# EasyEDA Pro project TES_Controller_V1.2.eprj

# Schematic Schematic1

## Sheets
1 P1: Board Name: Board1; Create Date: 2025-09-07; Page Name: P1; Project Name: TES_Controller_V1.2; Schematic Name: Schematic1; Update Date: 2025-09-17; Company: EasyEDA.com; Page Size: A4; Version: V1.0
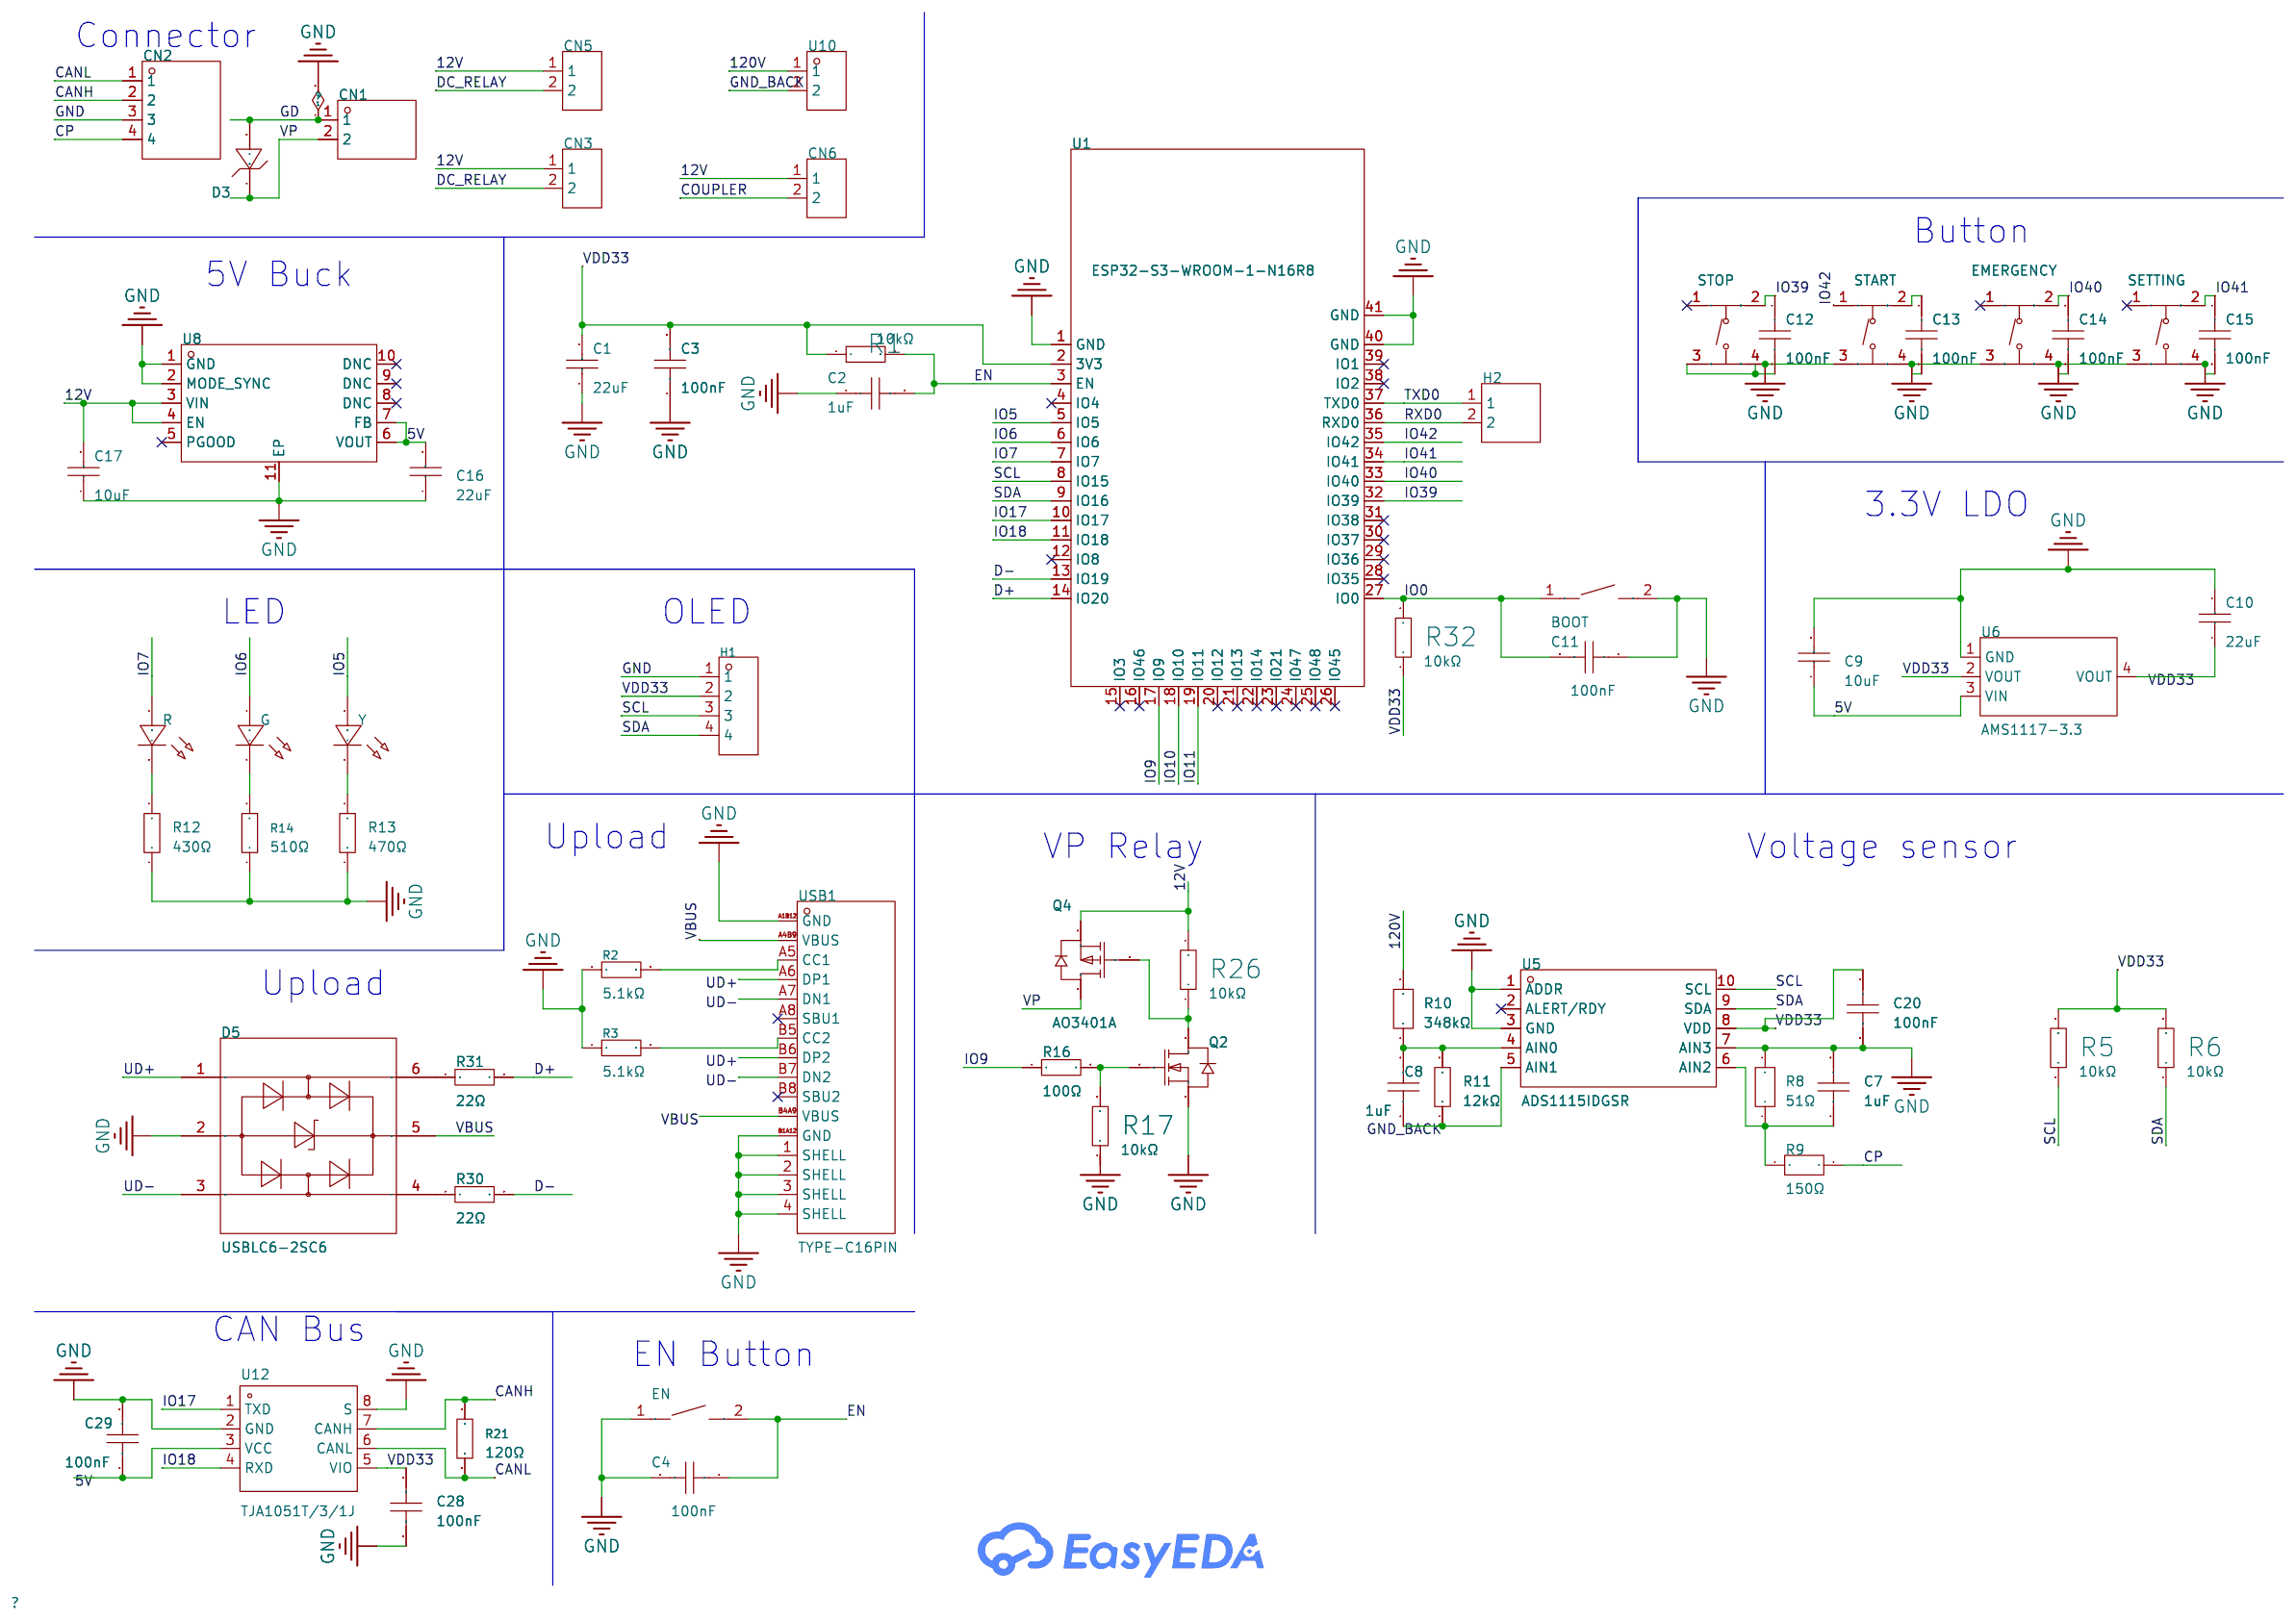
[diagram p0: P1]
2 P2: Create Date: 2025-08-19; Page Name: P2; Project Name: TES_Controller_V1.1; Update Date: 2025-08-23
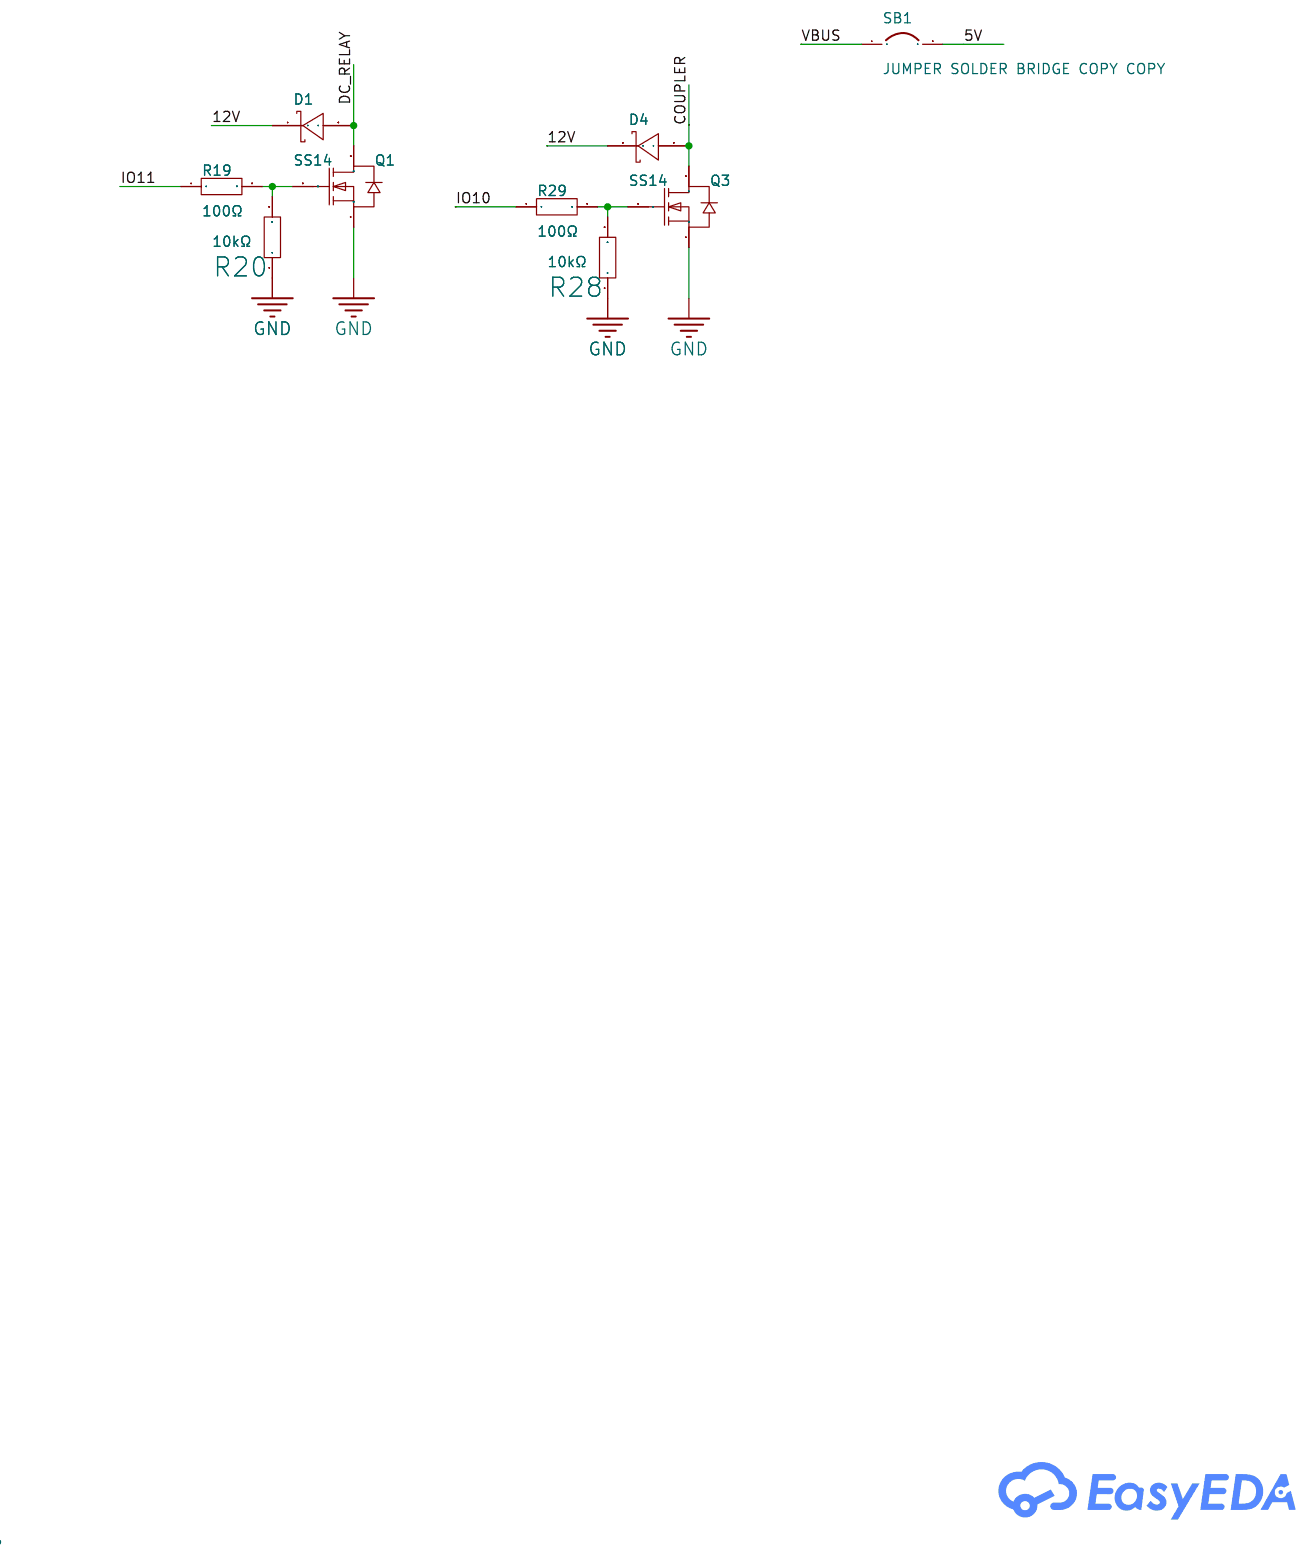
[diagram p1: P2]

## Parts
sheet P1
BOOT  TS-1088-AR02016  [SW-SMD_L3.9-W3.0-P4.45]
C1  22uF  [C1206]
C2  1uF  [C0603]
C3  100nF  [C0603]
C4  100nF  [C0603]
C7  1uF  [C0603]
C8  1uF  [C0603]
C9  10uF  [C1206]
C10  22uF  [C1206]
C11  100nF  [C0603]
C12  100nF  [C0603]
C13  100nF  [C0603]
C14  100nF  [C0603]
C15  100nF  [C0603]
C16  22uF  [C1206]
C17  10uF  [C1206]
C20  100nF  [C0603]
C28  100nF  [C0603]
C29  100nF  [C0603]
CN1  B2PS-VH(LF)(SN)  [CONN-TH_B2PS-VH-LF-SN]
CN2  S4B-XH-A(LF)(SN)  [CONN-TH_S4B-XH-A-LF-SN]
CN3  DG381-3.5-02P-14-00A(H)  [CONN-TH_2P-P3.50_DG381-3.5-02P-14-00A]
CN5  DG381-3.5-02P-14-00A(H)  [CONN-TH_2P-P3.50_DG381-3.5-02P-14-00A]
CN6  DG381-3.5-02P-14-00A(H)  [CONN-TH_2P-P3.50_DG381-3.5-02P-14-00A]
D3  SMBJ12A  [SMB_L4.6-W3.6-LS5.3-RD]
D5  USBLC6-2SC6  [SOT-23-6_L2.9-W1.6-P0.95-LS2.8-BL]
EMERGENCY  TS-1187A-B-A-B  [SW-SMD_4P-L5.1-W5.1-P3.70-LS6.5-TL_H1.5]
EN  TS-1088-AR02016  [SW-SMD_L3.9-W3.0-P4.45]
G  -  [LED-TH_BD5.8-P2.54-FD]  (no BOM)
H1  -  [HDR-TH_4P-P2.54-V-F]
H2  -  [HDR-TH_2P-P2.54-V-M-1]
Q2  AO3400A  [SOT-23-3_L2.9-W1.3-P1.90-LS2.4-BR]
Q4  AO3401A  [SOT-23_L2.9-W1.3-P1.90-LS2.4-BR]
R  -  [LED-TH_BD5.8-P2.54-FD]  (no BOM)
R1  10kΩ  [R0603]
R2  5.1kΩ  [R0402]
R3  5.1kΩ  [R0402]
R5  10kΩ  [R0603]
R6  10kΩ  [R0603]
R8  51Ω  [R1206]
R9  150Ω  [R1210]
R10  348kΩ  [R0603]
R11  12kΩ  [R0603]
R12  430Ω  [R0603]
R13  470Ω  [R0603]
R14  510Ω  [R0603]
R16  100Ω  [R0603]
R17  10kΩ  [R0603]
R21  120Ω  [R0603]
R26  10kΩ  [R0603]
R30  22Ω  [R0603]
R31  22Ω  [R0603]
R32  10kΩ  [R0603]
SETTING  TS-1187A-B-A-B  [SW-SMD_4P-L5.1-W5.1-P3.70-LS6.5-TL_H1.5]
START  TS-1187A-B-A-B  [SW-SMD_4P-L5.1-W5.1-P3.70-LS6.5-TL_H1.5]
STOP  TS-1187A-B-A-B  [SW-SMD_4P-L5.1-W5.1-P3.70-LS6.5-TL_H1.5]
U1  ESP32-S3-WROOM-1-N16R8  [WIRELM-SMD_ESP32-S3-WROOM-1]
U5  ADS1115IDGSR  [MSOP-10_L3.0-W3.0-P0.50-LS5.0-BL]
U6  AMS1117-3.3  [SOT-223-3_L6.5-W3.4-P2.30-LS7.0-BR]
U8  LMZM23601V5SILR  [USIP-10_L3.8-W3.0-TL_TI_SIL]
U10  DG301-5.0-02P-14-00A(H)  [CONN-TH_DEGSON_DG301-5.0-02P]
U12  TJA1051T/3/1J  [SOIC-8_L4.9-W3.9-P1.27-LS6.0-BL]
USB1  TYPE-C16PIN  [USB-C-SMD_TYPE-C16PIN]
Y  -  [LED-TH_BD5.8-P2.54-FD]  (no BOM)
sheet P2
D1  SS14  [SMA_L4.2-W2.6-LS5.0-RD_1]
D4  SS14  [SMA_L4.2-W2.6-LS5.0-RD_1]
Q1  AO3400A  [SOT-23-3_L2.9-W1.3-P1.90-LS2.4-BR]
Q3  AO3400A  [SOT-23-3_L2.9-W1.3-P1.90-LS2.4-BR]
R19  100Ω  [R0603]
R20  10kΩ  [R0603]
R28  10kΩ  [R0603]
R29  100Ω  [R0603]
SB1  Jumper  [PAD-JUMPER-2-NC_BY_PASTE_YES_SILK]

## Library data of the parts
BOOT EN = TS-1088-AR02016: LCSC Part Name: 4*3*2mm 立贴 轻触开关; Supplier Part: C720477; Manufacturer: XUNPU(讯普); Supplier Footprint: SMD; Datasheet: https://atta.szlcsc.com/upload/public/pdf/source/20200810/C720475_60D09DD6C54279ADDB2DC25100F1CC11.pdf; Supplier: LCSC; Circuit: SPST; Actuator Style: Round Button; Operating Force: 160gf; Mounting Style: Brick nogging; Switch Length: 4mm; Switch Width: 3mm; Switch Height: 2mm; Strike Gundam: 不带; Contact Current: 50mA; Voltage Rating (DC): 12V; Insulation Resistance: 100MΩ; Actuator/Cap Color: Black; Pin Style: SMDSplicing; Mechanical Life: 10万次; Operating Temperature: -30℃~+80℃; Check: true
C1 C10 C16 = CL31A226KAHNNNE: LCSC Part Name: 22uF ±10% 25V; Supplier Part: C12891; Manufacturer: SAMSUNG(三星); Supplier Footprint: 1206; JLCPCB Part Class: 基础库; Datasheet: https://atta.szlcsc.com/upload/public/pdf/source/20160218/1457707763339.pdf; Supplier: LCSC; Tolerance: ±10%; Check: true
C2 C7 C8 = CL10A105KB8NNNC: LCSC Part Name: 1uF ±10% 50V; Supplier Part: C15849; Manufacturer: SAMSUNG(三星); Supplier Footprint: 0603; JLCPCB Part Class: 基础库; Datasheet: https://atta.szlcsc.com/upload/public/pdf/source/20160218/1457707763339.pdf; Supplier: LCSC; Tolerance: ±10%; Check: true
C3 C4 C11-C15 C20 = CC0603KRX7R9BB104: LCSC Part Name: 100nF ±10% 50V; Supplier Part: C14663; Manufacturer: YAGEO(国巨); Supplier Footprint: 0603; JLCPCB Part Class: 基础库; Datasheet: https://atta.szlcsc.com/upload/public/pdf/source/20250214/096C4C206003071F5D32E5F0D8E7F8DF.pdf; Supplier: LCSC; Tolerance: ±10%; Voltage Rating: 50V; Temperature Coefficient: X7R; Check: true
C9 C17 = CL31A106KBHNNNE: LCSC Part Name: 10uF ±10% 50V; Supplier Part: C13585; Manufacturer: SAMSUNG(三星); Supplier Footprint: 1206; JLCPCB Part Class: 基础库; Datasheet: https://atta.szlcsc.com/upload/public/pdf/source/20160218/1457707763339.pdf; Supplier: LCSC; Tolerance: ±10%; Check: true
C28 C29 = CC0603KRX7R9BB104: LCSC Part Name: 100nF ±10% 50V; Supplier Part: C14663; Manufacturer: YAGEO(国巨); Supplier Footprint: 0603; JLCPCB Part Class: 基础库; Datasheet: https://atta.szlcsc.com/upload/public/pdf/source/20250214/096C4C206003071F5D32E5F0D8E7F8DF.pdf; Supplier: LCSC; Tolerance: ±10%; Voltage Rating: 50V; Temperature Coefficient: X7R
CN1 = B2PS-VH(LF)(SN): LCSC Part Name: 1x2P 间距:3.96mm 弯插 系列:VH; Supplier Part: C158007; Manufacturer: JST; Supplier Footprint: 弯插,P=3.96mm; Datasheet: https://atta.szlcsc.com/upload/public/pdf/source/20180807/C267111_104B2B82EF5D002133F5063D0D7C94AB.pdf; Supplier: LCSC; Pins Structure: 1x2P; Pitch: 3.96mm; Mounting Style: Bend insert; Reference Series: VH; Number of Pins: 2P; Number of Rows: 1; Number of PINs Per Row: 2; Current Rating (Max): 10A; Contact Material: Brass; Contact Plating: Tin; Operating Temperature Range: -25℃~+85℃; Rated Voltage (Max): 250V; Plastic Material: PA66; Flame Retardant Rating: UL94V-0; Colour: White; Z-Height of the Board: 8.5mm; X-Length of Bottom Edge on Board (Spacing Line): 7.86mm; Y-Width of Bottom Edge on Board: 14.9mm; Check: true
CN2 = S4B-XH-A(LF)(SN): LCSC Part Name: 1x4P 间距:2.5mm 弯插 系列:XH; Supplier Part: C157925; Manufacturer: JST; Supplier Footprint: 弯插,P=2.5mm; Datasheet: https://atta.szlcsc.com/upload/public/pdf/source/20180928/C265283_F9DFEEBDB2CF642B6BDFAB4B77BD2680.pdf; Supplier: LCSC; Pins Structure: 1x4P; Pitch: 2.5mm; Mounting Style: Bend insert; Reference Series: XH; Number of Pins: 4P; Number of Rows: 1; Number of PINs Per Row: 4; Current Rating (Max): 3A; Contact Material: Brass; Contact Plating: Tin; Operating Temperature Range: -25℃~+85℃; Rated Voltage (Max): 250V; Plastic Material: PA66; Flame Retardant Rating: UL94V-0; Supplementary Features: K-leg punch; Colour: White; Z-Height of the Board: 6.1mm; X-Length of Bottom Edge on Board (Spacing Line): 12.4mm; Y-Width of Bottom Edge on Board: 11.5mm; Check: true
CN3 CN5 CN6 = DG381-3.5-02P-14-00A(H): LCSC Part Name: 3.5mm 直插 排数:1 每排P数:2; Supplier Part: C5272864; Manufacturer: DEGSON(高正/高松); Supplier Footprint: 插件,P=3.5mm; Datasheet: https://atta.szlcsc.com/upload/public/pdf/source/20221116/069171FF23C61B982410A9A369C7D043.pdf; Supplier: LCSC; Pitch: 3.5mm; Mounting Type: Direct Insert; Number of Pins: 2P; Number of Rows: 1; Number of PINs Per Row: 2; Check: true
D3 = SMBJ12A_C908793: Polarity:Unidirectional Reverse Stand-Off Voltage (Vrwm):12V Clamping Voltage:19.9V Peak Pulse Current (Ipp):30.2A Peak Pulse Power Dissipation (Ppp):600W Voltage - Breakdown:13.3V Reverse Leakage Current (Ir):5uA Operating Temperature:-55℃~+150℃@(Tj) Ope; LCSC Part Name: 单向TVS 12V截止 30.2A峰值脉冲; Supplier Part: C908793; Manufacturer: GOODWORK(固得沃克); Supplier Footprint: DO-214AA(SMB); JLCPCB Part Class: 扩展库; Datasheet: https://item.szlcsc.com/datasheet/SMBJ12A/975545.html; Supplier: LCSC; Polarity: Unidirectional; Reverse Stand-Off Voltage (Vrwm): 12V; Clamping Voltage: 19.9V; Peak Pulse Current (Ipp): 30.2A; Peak Pulse Power Dissipation (Ppp): 600W; Voltage - Breakdown: 13.3V; Reverse Leakage Current (Ir): 5uA; Operating Temperature: -55℃~+150℃@(Tj); Type: TVS
D5 = USBLC6-2SC6_C7519: Polarity:Unidirectional Reverse Stand-Off Voltage (Vrwm):5.25V Clamping Voltage:17V Peak Pulse Current (Ipp):5A Voltage - Breakdown:6V Reverse Leakage Current (Ir):150nA Number of Channels:2 Operating Temperature:-40℃~+125℃ Operating Temperature:-40℃~+125; LCSC Part Name: 单向ESD; Supplier Part: C7519; Manufacturer: ST(意法半导体); Supplier Footprint: SOT-23-6L; Datasheet: https://item.szlcsc.com/datasheet/USBLC6-2SC6/7996.html; Supplier: LCSC; Polarity: Unidirectional; Reverse Stand-Off Voltage (Vrwm): 5.25V; Clamping Voltage: 17V; Peak Pulse Current (Ipp): 5A; Voltage - Breakdown: 6V; Reverse Leakage Current (Ir): 150nA; Number of Channels: 2; Operating Temperature: -40℃~+125℃; level of protection: IEC 61000-4-2; Type: ESD; Junction Capacitance: 3.5pF
EMERGENCY SETTING START STOP = TS-1187A-B-A-B: LCSC Part Name: 5.1*5.1*1.5mm 立贴 轻触开关; Supplier Part: C318884; Manufacturer: XKB Connectivity(中国星坤); Supplier Footprint: SMD; JLCPCB Part Class: 基础库; Datasheet: https://atta.szlcsc.com/upload/public/pdf/source/20200227/C318890_053E50208A88A7BA1965D8746000774E.pdf; Supplier: LCSC; Circuit: SPST; Actuator Style: Round Button; Operating Force: 160gf; Mounting Style: Brick nogging; Switch Length: 5.1mm; Switch Width: 5.1mm; Switch Height: 1.5mm; Strike Gundam: 不带; Contact Current: 50mA; Voltage Rating (DC): 12V; Actuator/Cap Color: 金色; With Lamp: No; Mechanical Life: 10万次; Operating Temperature: -30℃~+85℃; Check: true
G R Y = LED_TH-R_5mm: Supplier Footprint: Through
H1 = HDR-F_2.54_1x4P: Supplier Footprint: Through; Check: true
H2 = HDR-M_2.54_1x2P: Supplier Footprint: Through
Q1-Q3 = AO3400A_C20917: Type:1 N-Channel Drain Source Voltage (Vdss): Continuous Drain Current (Id): Drain Source On Resistance (RDS(on)@Vgs,Id):26.5mΩ@10V,5.7A Power Dissipation (Pd): Gate Threshold Voltage (Vgs(th)@Id):1.5V@250uA Total Gate Charge (Qg@Vgs):7nC@4.5V Input Capac; LCSC Part Name: 1个N沟道 耐压:30V 电流:5.7A; Supplier Part: C20917; Manufacturer: AOS; Supplier Footprint: SOT-23-3L; JLCPCB Part Class: Basic Part; Datasheet: https://atta.szlcsc.com/upload/public/pdf/source/20140107/1457706668533.pdf; Supplier: LCSC; Type: 1 N-Channel; Drain Source On Resistance (RDS(on)@Vgs,Id): 26.5mΩ@10V,5.7A; Gate Threshold Voltage (Vgs(th)@Id): 1.5V@250uA; Total Gate Charge (Qg@Vgs): 7nC@4.5V; Input Capacitance (Ciss@Vds): 630pF@15V; Operating Temperature: -55℃~+150℃@(Tj)
Q4 = AO3401A_C15127: Number:1 P-Channel Drain to Source Voltage:30V Current - Continuous Drain(Id):4A RDS(on):47mΩ@10V；85mΩ@2.5V；60mΩ@4.5V Pd - Power Dissipation:- Gate Threshold Voltage (Vgs(th)):900mV@250uA Gate Charge(Qg):14nC@10V Input Capacitance(Ciss):645pF Reverse Tran; LCSC Part Name: 1个P沟道 耐压:30V 电流:4A; Supplier Part: C15127; Manufacturer: AOS; Supplier Footprint: SOT-23; JLCPCB Part Class: 基础库; Datasheet: https://item.szlcsc.com/datasheet/AO3401A/15801.html; Supplier: LCSC; Number: 1 P-Channel; Drain to Source Voltage: 30V; Current - Continuous Drain(Id): 4A; RDS(on): 47mΩ@10V；85mΩ@2.5V；60mΩ@4.5V; Gate Threshold Voltage (Vgs(th)): 900mV@250uA; Gate Charge(Qg): 14nC@10V; Input Capacitance(Ciss): 645pF; Reverse Transfer Capacitance (Crss@Vds): 55pF; Output Capacitance(Coss): 80pF
R1 R5 R6 R20 R28 R32 = 0603WAF1002T5E: LCSC Part Name: 厚膜电阻 10kΩ ±1% 100mW; Supplier Part: C25804; Manufacturer: UNI-ROYAL(厚声); Supplier Footprint: 0603; JLCPCB Part Class: 基础库; Datasheet: https://atta.szlcsc.com/upload/public/pdf/source/20200306/C422600_1E6D84923E4A46A82E41ADD87F860B5C.pdf; Supplier: LCSC; Type: Thick Film Resistor; Tolerance: ±1%; Power(Watts): 100mW; Voltage-Supply(Max): 75V; Temperature Coefficient: ±100ppm/℃; Operating Temperature: -55℃~+155℃; Check: true
R2 R3 = 0402WGF5101TCE: LCSC Part Name: 5.1kΩ ±1% 62.5mW 厚膜电阻; Supplier Part: C25905; Manufacturer: UNI-ROYAL(厚声); Supplier Footprint: 0402; Datasheet: https://atta.szlcsc.com/upload/public/pdf/source/20200306/C422600_1E6D84923E4A46A82E41ADD87F860B5C.pdf; Supplier: LCSC; Type: Thick Film Resistors; Tolerance: ±1%; Temperature Coefficient: ±100ppm/℃; Operating Temperature Range: -55℃~+155℃; Check: true
R8 = FRP1206F51R0TS: LCSC Part Name: 厚膜电阻 51Ω ±1% 500mW; Supplier Part: C7468320; Manufacturer: FOJAN(富捷); Supplier Footprint: 1206; JLCPCB Part Class: 扩展库; Datasheet: https://atta.szlcsc.com/upload/public/pdf/source/20230915/D88BDA77B27A9698C44CA869125B965F.pdf; Supplier: LCSC; Type: Thick Film Resistor; Tolerance: ±1%; Power(Watts): 500mW; Temperature Coefficient: ±200ppm/℃; Check: true
R9 = FRC1210F1500TS: LCSC Part Name: 厚膜电阻 150Ω ±1% 500mW; Supplier Part: C2933805; Manufacturer: FOJAN(富捷); Supplier Footprint: 1210; Datasheet: https://atta.szlcsc.com/upload/public/pdf/source/20240815/E4F1531D1C60085E6B84901F2C57F42A.pdf; Supplier: LCSC; Type: Thick Film Resistors; Tolerance: ±1%; Temperature Coefficient: ±100ppm/℃; Operating Temperature Range: -55℃~+155℃; Check: true
R10 = RT0603BRD07348KL: LCSC Part Name: 薄膜电阻 348kΩ ±0.1% 100mW; Supplier Part: C861336; Manufacturer: YAGEO(国巨); Supplier Footprint: 0603; Datasheet: https://item.szlcsc.com/datasheet/RT0603BRD07348KL/921674.html; Supplier: LCSC; Type: Thin Film Resistor; Tolerance: ±0.1%; Power(Watts): 100mW; Temperature Coefficient: ±25ppm/℃; Operating Temperature: -55℃~+155℃
R11 = RT0603BRD0712KL: LCSC Part Name: 薄膜电阻 12kΩ ±0.1% 100mW; Supplier Part: C326735; Manufacturer: YAGEO(国巨); Supplier Footprint: 0603; JLCPCB Part Class: 扩展库; Datasheet: https://atta.szlcsc.com/upload/public/pdf/source/20181031/C326735_4104B15733CB2D0B2F5DDB60451654E8.pdf; Supplier: LCSC; Type: Thin Film Resistor; Tolerance: ±0.1%; Temperature Coefficient: ±25ppm/℃; Operating Temperature Range: -55℃~+155℃; Check: true
R12 = RC0603FR-07430RL: LCSC Part Name: 厚膜电阻 430Ω ±1% 100mW; Supplier Part: C137721; Manufacturer: YAGEO(国巨); Supplier Footprint: 0603; JLCPCB Part Class: 扩展库; Datasheet: https://atta.szlcsc.com/upload/public/pdf/source/20180821/C275644_0D56F95EFF785E7D9A1FEF436B37DA78.pdf; Supplier: LCSC; Type: Thick Film Resistors; Tolerance: ±1%; Temperature Coefficient: ±100ppm/℃; Operating Temperature Range: -55℃~+155℃; Check: true
R13 = 0603WAF4700T5E: LCSC Part Name: 470Ω ±1% 100mW 厚膜电阻; Supplier Part: C23179; Manufacturer: UNI-ROYAL(厚声); Supplier Footprint: 0603; JLCPCB Part Class: 基础库; Datasheet: https://atta.szlcsc.com/upload/public/pdf/source/20200306/C422600_1E6D84923E4A46A82E41ADD87F860B5C.pdf; Supplier: LCSC; Type: Thick Film Resistors; Tolerance: ±1%; Temperature Coefficient: ±100ppm/℃; Operating Temperature Range: -55℃~+155℃; Check: true
R14 = 0603WAF5100T5E: LCSC Part Name: 510Ω ±1% 100mW 厚膜电阻; Supplier Part: C23193; Manufacturer: UNI-ROYAL(厚声); Supplier Footprint: 0603; Datasheet: https://atta.szlcsc.com/upload/public/pdf/source/20200306/C422600_1E6D84923E4A46A82E41ADD87F860B5C.pdf; Supplier: LCSC; Type: Thick Film Resistors; Tolerance: ±1%; Temperature Coefficient: ±100ppm/℃; Operating Temperature Range: -55℃~+155℃; Check: true
R16 R19 R29 = 0603WAF1000T5E: Type:Thick Film Resistors Resistance: Tolerance:±1% Tolerance:±1% Power(Watts): Overload Voltage (Max): Temperature Coefficient:±200ppm/℃ Temperature Coefficient:±200ppm/℃ Operating Temperature Range:-55℃~+155℃ Operating Temperature Range:-55℃~+155℃; LCSC Part Name: 100Ω ±1% 100mW 厚膜电阻; Supplier Part: C22775; Manufacturer: UNI-ROYAL(厚声); Supplier Footprint: 0603; JLCPCB Part Class: 基础库; Datasheet: https://atta.szlcsc.com/upload/public/pdf/source/20200306/C422600_1E6D84923E4A46A82E41ADD87F860B5C.pdf; Supplier: LCSC; Type: Thick Film Resistors; Tolerance: ±1%; Temperature Coefficient: ±200ppm/℃; Operating Temperature Range: -55℃~+155℃
R17 R26 = 0603WAF1002T5E: LCSC Part Name: 厚膜电阻 10kΩ ±1% 100mW; Supplier Part: C25804; Manufacturer: UNI-ROYAL(厚声); Supplier Footprint: 0603; JLCPCB Part Class: 基础库; Datasheet: https://atta.szlcsc.com/upload/public/pdf/source/20200306/C422600_1E6D84923E4A46A82E41ADD87F860B5C.pdf; Supplier: LCSC; Type: Thick Film Resistor; Tolerance: ±1%; Power(Watts): 100mW; Voltage-Supply(Max): 75V; Temperature Coefficient: ±100ppm/℃; Operating Temperature: -55℃~+155℃
R21 = 0603WAF1200T5E: LCSC Part Name: 120Ω ±1% 100mW 厚膜电阻; Supplier Part: C22787; Manufacturer: UNI-ROYAL(厚声); Supplier Footprint: 0603; JLCPCB Part Class: 基础库; Datasheet: https://atta.szlcsc.com/upload/public/pdf/source/20200306/C422600_1E6D84923E4A46A82E41ADD87F860B5C.pdf; Supplier: LCSC; Type: Thick Film Resistors; Tolerance: ±1%; Temperature Coefficient: ±100ppm/℃; Operating Temperature Range: -55℃~+155℃
R30 R31 = 0603WAF220JT5E: Type:Thick Film Resistors Resistance:22Ω Tolerance:±1% Tolerance:±1% Power(Watts): Overload Voltage (Max): Temperature Coefficient:±100ppm/℃ Temperature Coefficient:±100ppm/℃ Operating Temperature Range:-55℃~+155℃ Operating Temperature Range:-55℃~+155℃; LCSC Part Name: 22Ω ±1% 100mW 厚膜电阻; Supplier Part: C23345; Manufacturer: UNI-ROYAL(厚声); Supplier Footprint: 0603; JLCPCB Part Class: 基础库; Datasheet: https://atta.szlcsc.com/upload/public/pdf/source/20200306/C422600_1E6D84923E4A46A82E41ADD87F860B5C.pdf; Supplier: LCSC; Type: Thick Film Resistors; Tolerance: ±1%; Temperature Coefficient: ±100ppm/℃; Operating Temperature Range: -55℃~+155℃
U1 = ESP32-S3-WROOM-1-N16R8: LCSC Part Name: 通用型Wi-Fi+低功耗蓝牙MCU模组; Supplier Part: C2913202; Manufacturer: ESPRESSIF(乐鑫); Supplier Footprint: SMD,18x25.5mm; JLCPCB Part Class: 扩展库; Datasheet: https://atta.szlcsc.com/upload/public/pdf/source/20241030/6A412B13087E1327DF6279F5735253CA.pdf; Supplier: LCSC; Check: true
U5 = ADS1115IDGSR: LCSC Part Name: 具有内部基准、振荡器和可编程比较器且兼容 I2C 的ADS111x、超小型、低功耗 860SPS、16位ADC; Supplier Part: C37593; Manufacturer: TI(德州仪器); Supplier Footprint: VSSOP-10; JLCPCB Part Class: 扩展库; Datasheet: https://www.ti.com/cn/lit/gpn/ads1115; Supplier: LCSC; Resolution(Bits): 16Bit; number of channels: 4; Voltage - Supply: 2V~5.5V; Interface: I2C; Integral non - linearity: 1LSB; Operating Temperature: -40℃~+125℃; Check: true
U6 = AMS1117-3.3_C6186: LCSC Part Name: 输出3.3V 1A; Supplier Part: C6186; Manufacturer: AMS; Supplier Footprint: SOT-223; JLCPCB Part Class: 基础库; Datasheet: https://atta.szlcsc.com/upload/public/pdf/source/20180727/C6186_7A095716F0823C02F1997A905E26C086.pdf; Supplier: LCSC; Output Type: Fixed; Voltage - Supply: 16V; Output Voltage: 3.3V; Output Current: 1A; Power Supply Rejection Ratio (PSRR): 72dB@(120Hz); Voltage Dropout: 1.1V@(800mA); standby current: 5mA; Features: Over Current Protection；Over Temperature Protection; Operating Temperature: -40℃~+125℃; Output Configuration: Positive; Number of Outputs: 1; Check: true
U8 = LMZM23601V5SILR: Supplier Part: C2868357; Manufacturer: TI(德州仪器); Supplier Footprint: USIP-10; JLCPCB Part Class: 扩展库; Datasheet: https://www.ti.com/cn/lit/gpn/lmzm23601; Supplier: LCSC; Input Voltage(DC): 4V~36V; Output Voltage: 5V; Output Current (Max): 1A; Output Channel: 1; Conversion Efficiency: 87%; Check: true
U10 = DG301-5.0-02P-14-00A(H): LCSC Part Name: 5mm 直插 排数:1 每排P数:2; Supplier Part: C5128812; Manufacturer: DEGSON(高正/高松); Supplier Footprint: 插件,P=5mm; Datasheet: https://atta.szlcsc.com/upload/public/pdf/source/20220616/FBEDEC35C713F5559304A8F5E5617E2B.pdf; Supplier: LCSC; Pitch: 5mm; Mounting Style: Direct Insert; Number of Pins: 2P; Number of Rows: 1; Number of PINs Per Row: 2; Check: true
U12 = TJA1051T/3/1J: Supplier Part: C38695; Manufacturer: NXP(恩智浦); Supplier Footprint: SOIC-8-150mil; JLCPCB Part Class: 扩展库; Datasheet: https://www.nxp.com/docs/en/data-sheet/TJA1051.pdf; Supplier: LCSC; Data Rate: 5Mbps; Supply Voltage: 4.5V~5.5V; Supply Current: 5mA; Operating Temperature: -40℃~+150℃
USB1 = TYPE-C16PIN: LCSC Part Name: Type-C 母 卧贴; Supplier Part: C393939; Manufacturer: SHOU HAN(首韩); Supplier Footprint: SMD; JLCPCB Part Class: 扩展库; Datasheet: https://atta.szlcsc.com/upload/public/pdf/source/20250618/9FBF2A26CFCE0E69298FA0B726710E9E.pdf; Supplier: LCSC; Connector Type: Type-C; Protocol Standard: USB 3.1; Gender: Female; Mounting Type: Surface Mount, Right Angle; Number of Contacts: 16P; Number of Ports: 1; Current Rating-Power: 3A; Voltage Rating: 30V; Connect-Disconnect Life: 10,000 Cycles; Detection color: Black; Operating Temperature: -40℃~+85℃; Check: true
D1 D4 = SS14_C2480: LCSC Part Name: 电压:40V 电流:1A; Supplier Part: C2480; Manufacturer: MDD(辰达半导体); Supplier Footprint: SMA(DO-214AC); JLCPCB Part Class: 基础库; Datasheet: https://atta.szlcsc.com/upload/public/pdf/source/20241121/B157EB417161760A7ED23035C0FAAB28.pdf; Supplier: LCSC; Diode Configuration: Independent; Voltage - Forward(Vf@If): 550mV@1A; Voltage - DC Reverse(Vr): 40V; Current - Rectified: 1A; Reverse Leakage Current (Ir): 300uA@40V; Check: true
SB1 = JUMPER SOLDER BRIDGE COPY COPY: Supplier: LCSC; Supplier Part: C21189; Manufacturer: NONE; Manufacturer Part: 0603WAF0000T5E; Check: false

## Nets
5V: C9.1 C16.2 C29.1 SB1.2 U6.3(VIN) U8.6(VOUT) U8.7(FB) U12.3(VCC)
12V: C17.2 CN3.1 CN5.1 CN6.1 D1.1(K) D4.1(K) Q4.2(S) R26.2 U8.3(VIN) U8.4(EN)
120V: R10.2 U10.1
GND: BOOT.2 C1.1 C2.1 C3.1 C4.2 C7.2 C9.2 C10.2 C11.1 C12.2 C13.2 C14.2 C15.2 C16.1 C17.1 C20.2 C28.1 C29.2 CN1.1 CN2.3 D3.2(A) D5.2 EMERGENCY.3(C) EMERGENCY.4(D) EN.1 H1.1 Q1.1(S) Q2.1(S) Q3.1(S) R2.1 R3.1 R8.2 R12.1 R13.1 R14.1 R17.1 R20.1 R28.1 SETTING.3(C) SETTING.4(D) START.3(C) START.4(D) STOP.3(C) STOP.4(D) U1.1(GND) U1.40(GND) U1.41(GND) U5.1(ADDR) U5.3(GND) U5.7(AIN3) U6.1(GND) U8.1(GND) U8.2(MODE_SYNC) U8.11(EP) U12.2(GND) U12.8(S) USB1.1(SHELL) USB1.2(SHELL) USB1.3(SHELL) USB1.4(SHELL) USB1.A1B12(GND) USB1.B1A12(GND)
GND_BACK: C8.1 R11.1 U5.5(AIN1) U10.2
VBUS: D5.5 SB1.1 USB1.A4B9(VBUS) USB1.B4A9(VBUS)
VDD33: C1.2 C3.2 C10.1 C20.1 C28.2 H1.2 R1.1 R5.2 R6.2 R32.1 U1.2(3V3) U5.8(VDD) U6.2(VOUT) U6.4(VOUT) U12.5(VIO)
CANH: CN2.2 R21.1 U12.7(CANH)
CANL: CN2.1 R21.2 U12.6(CANL)
COUPLER: CN6.2 D4.2(A) Q3.3(D)
CP: CN2.4 R9.1
D+: R31.2 U1.14(IO20)
D-: R30.2 U1.13(IO19)
DC_RELAY: CN3.2 CN5.2 D1.2(A) Q1.3(D)
EN: C2.2 C4.1 EN.2 R1.2 U1.3(EN)
IO0: BOOT.1 C11.2 R32.2 U1.27(IO0)
IO5: U1.5(IO5) Y.1(C)
IO6: G.1(C) U1.6(IO6)
IO7: R.1(C) U1.7(IO7)
IO9: R16.1 U1.17(IO9)
IO10: R29.1 U1.18(IO10)
IO11: R19.1 U1.19(IO11)
IO17: U1.10(IO17) U12.1(TXD)
IO18: U1.11(IO18) U12.4(RXD)
IO39: C12.1 STOP.2(B) U1.32(IO39)
IO40: C14.1 EMERGENCY.2(B) U1.33(IO40)
IO41: C15.1 SETTING.2(B) U1.34(IO41)
IO42: START.1(A) U1.35(IO42)
RXD0: H2.2 U1.36(RXD0)
SCL: H1.3 R5.1 U1.8(IO15) U5.10(SCL)
SDA: H1.4 R6.1 U1.9(IO16) U5.9(SDA)
TXD0: H2.1 U1.37(TXD0)
UD+: D5.1 USB1.A6(DP1) USB1.B6(DP2)
UD-: D5.3 USB1.A7(DN1) USB1.B7(DN2)
VP: CN1.2 D3.1(C) Q4.3(D)
$1N24268: R13.2 Y.2(A)
$1N24269: G.2(A) R14.2
$1N24273: R.2(A) R12.2
$1N24295: R2.2 USB1.A5(CC1)
$1N24313: C7.1 R8.1 R9.2 U5.6(AIN2)
$1N24345: C8.2 R10.1 R11.2 U5.4(AIN0)
$1N24383: C13.1 START.2(B)
$1N24443: R3.2 USB1.B5(CC2)
$1N35533: Q2.3(D) Q4.1(G) R26.1
$1N35540: Q2.2(G) R16.2 R17.2
$1N38322: D5.6 R31.1
$1N38324: D5.4 R30.1
$3N445: Q1.2(G) R19.2 R20.2
$3N451: Q3.2(G) R28.2 R29.2

Not connected (* = marked no-connect by the designer): EMERGENCY 1(A)*; SETTING 1(A)*; STOP 1(A)*; U1 4(IO4)* 12(IO8)* 15(IO3)* 16(IO46)* 20(IO12)* 21(IO13)* 22(IO14)* 23(IO21)* 24(IO47)* 25(IO48)* 26(IO45)* 28(IO35)* 29(IO36)* 30(IO37)* 31(IO38)* 38(IO2)* 39(IO1)*; U5 2(ALERT/RDY)*; U8 5(PGOOD)* 8(DNC)* 9(DNC)* 10(DNC)*; USB1 A8(SBU1)* B8(SBU2)*

## Notes on the sheets
sheet 1
- Connector
- Button
- 5V Buck
- 3.3V LDO
- LED
- OLED
- Upload
- VP Relay
- Voltage sensor
- Upload
- CAN Bus
- EN Button

# Board PCB1
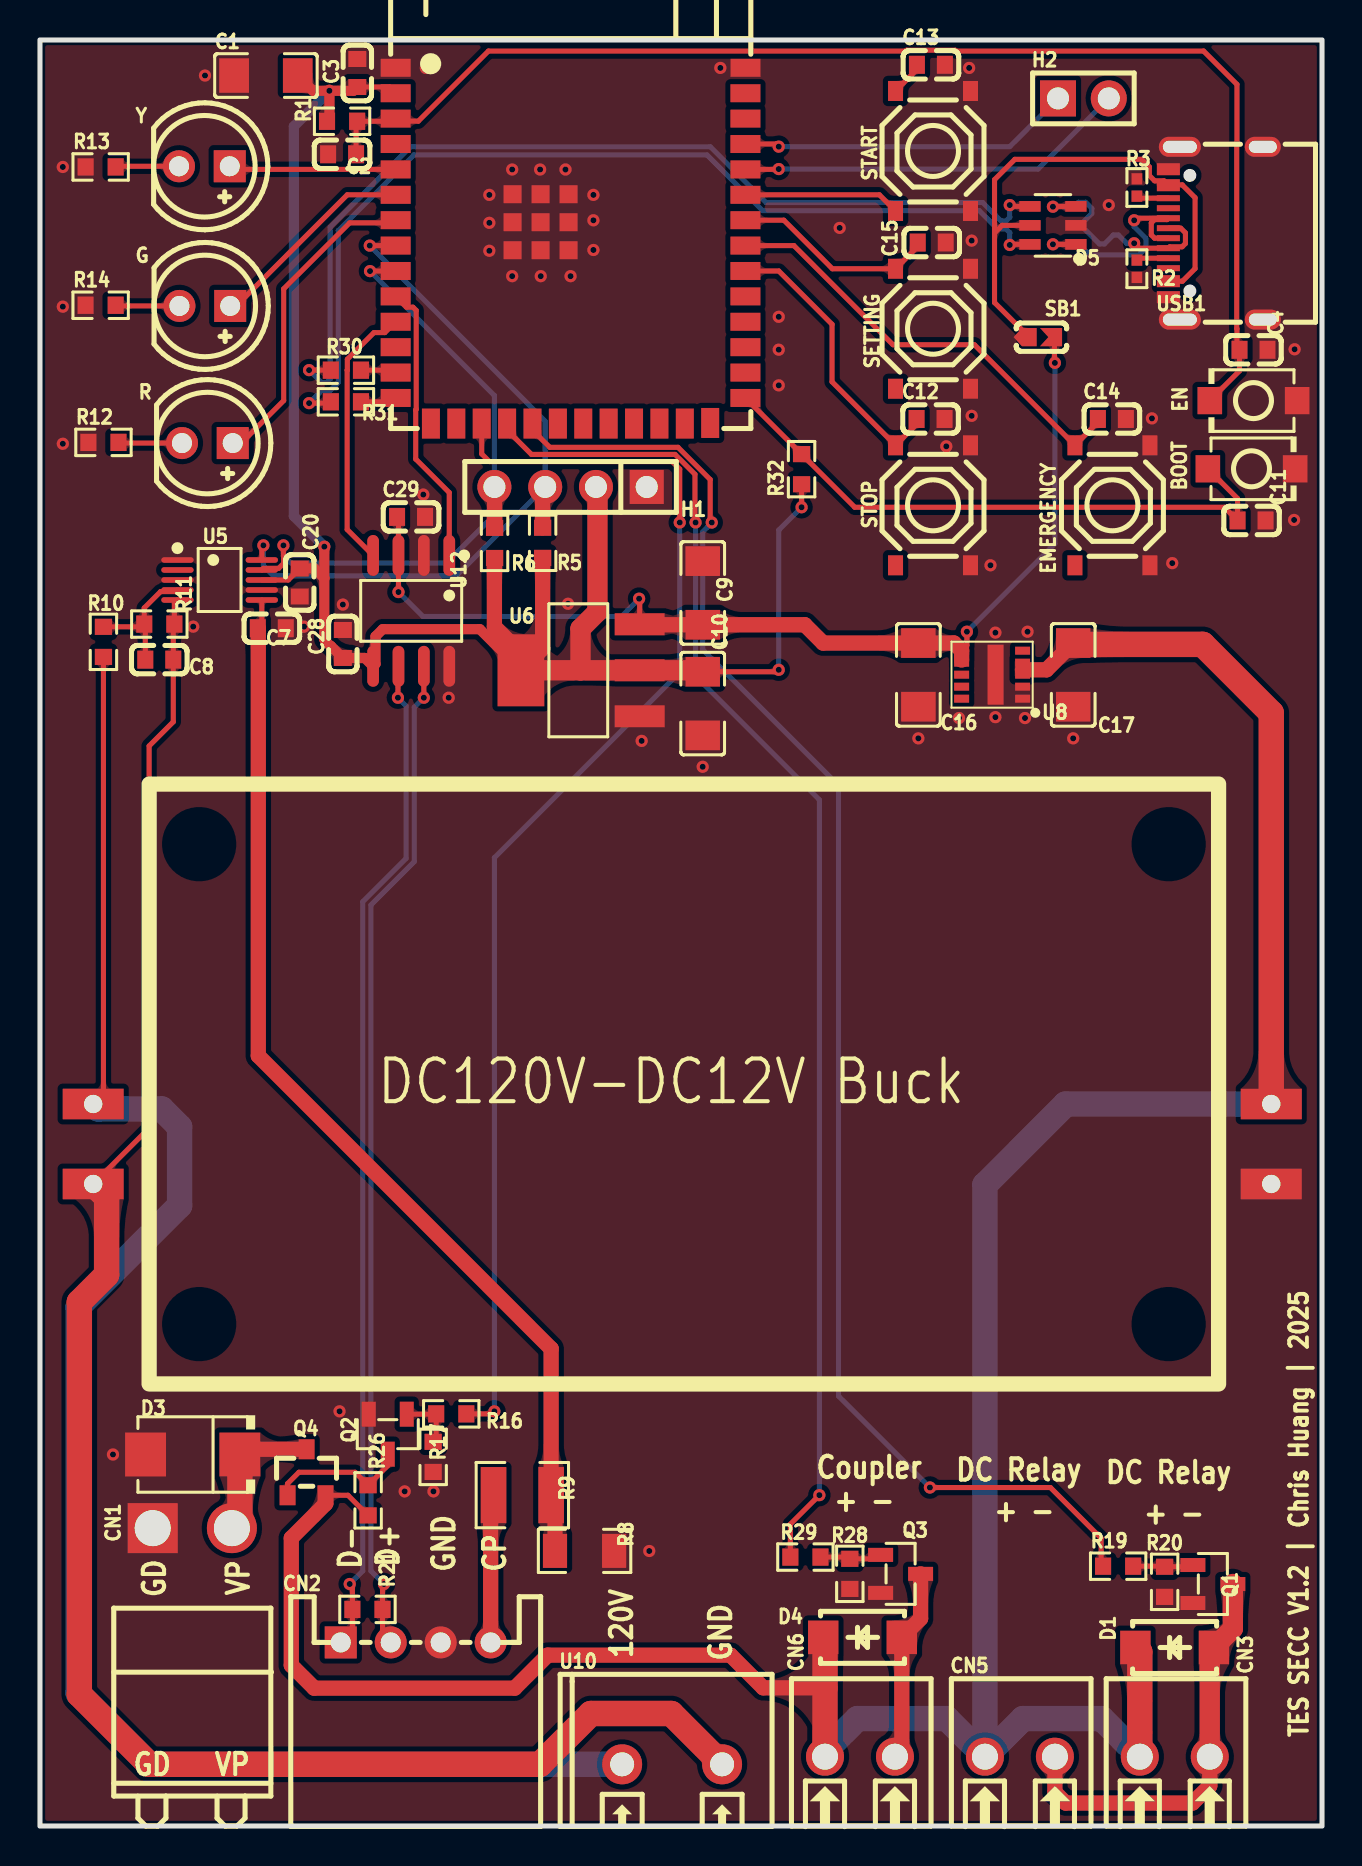
[diagram p2: board, top side]
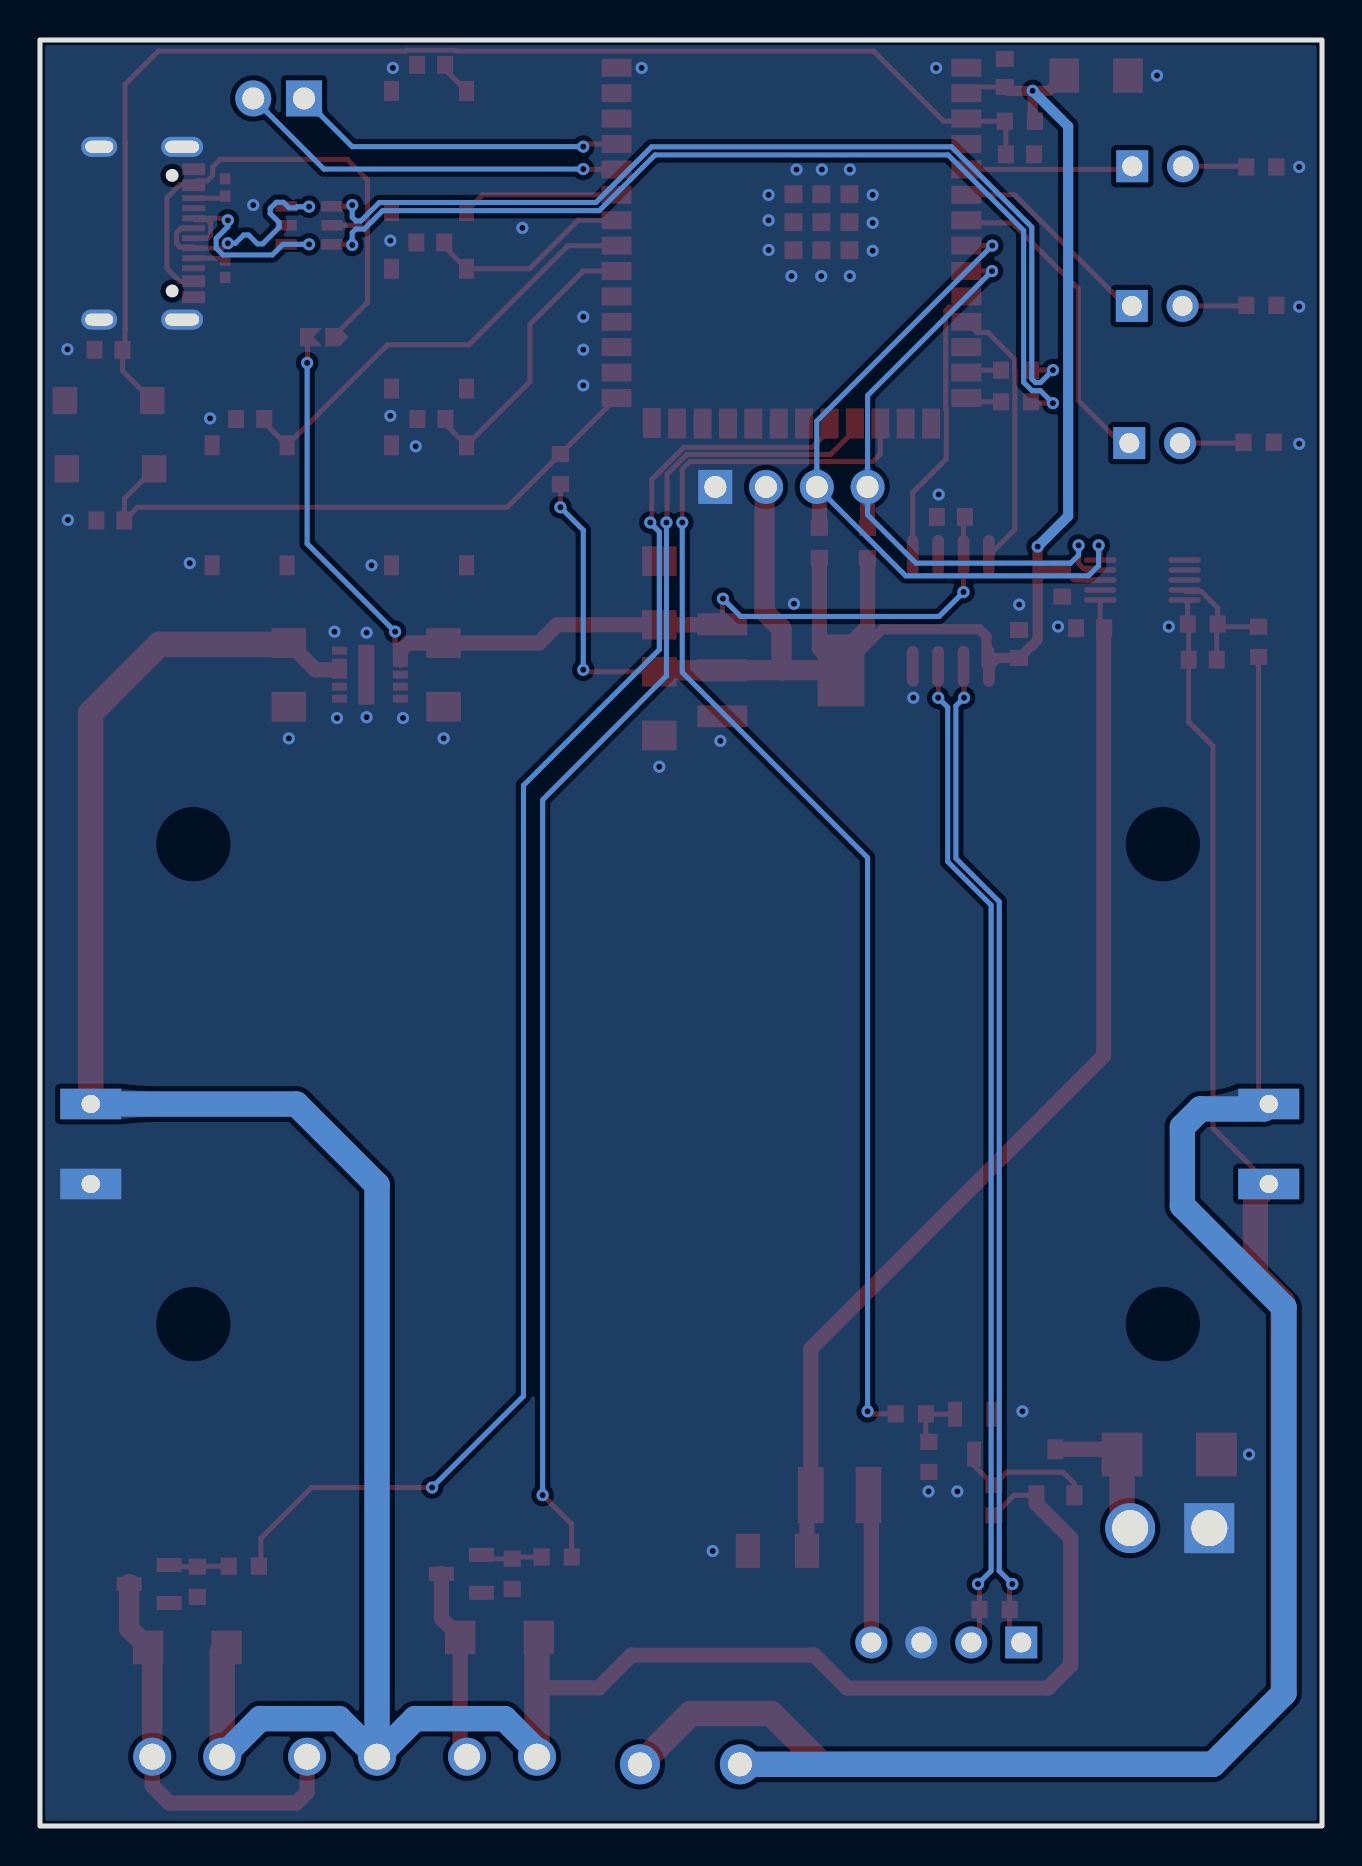
[diagram p3: board, bottom side, seen from below]

Outline 64.13 x 89.32 mm; copper layers: Top Layer, Bottom Layer. Coordinates in mm from the lower left corner of the outline.
Outline path: rectangle 0,89.32 64.13,0
Stack: Top Layer 0.035mm / Dielectric1 1.51mm FR4 er 4.5 / Bottom Layer 0.035mm

## Design rules (mm)
net CANL: DP2
net CANH: DP2
net UD+: DP1
net UD-: DP1
net $1N38324: DP3
net $1N38322: DP3
template: 自定义配置
spacing copperThickness1oz (default): track to track 0.102, other pairs 0.152 to 0.3
spacing copperThickness2oz: track to track 0.203, other pairs 0.152 to 0.3
track width copperThickness1oz (default): min 0.127, default 0.254, max 2.54
track width copperThickness2oz: min 0.203, default 0.254, max 2.54
differential pair differentialPair (default): width min 0.127, default 0.254, max 2.54; gap min 0.152, default 0.152
via viaSize (default): diameter min 0.5, default 0.61, max 10; hole min 0.3, default 0.305, max 6.3

## Placement (name value [footprint] x y rotation side)
BOOT  TS-1088-AR02016  [SW-SMD_L3.9-W3.0-P4.45]  60.61 67.87 0 top
C1  22uF  [C1206]  11.3 87.54 0 top
C2  1uF  [C0603]  15.11 83.6 0 top
C3  100nF  [C0603]  15.88 87.67 270 top
C4  100nF  [C0603]  60.71 73.82 0 top
C7  1uF  [C0603]  11.6 59.9 0 top
C8  1uF  [C0603]  5.97 58.33 180 top
C9  10uF  [C1206]  33.15 61.67 90 top
C10  22uF  [C1206]  33.15 56.13 270 top
C11  100nF  [C0603]  60.61 65.29 180 top
C12  100nF  [C0603]  44.55 70.37 0 top
C13  100nF  [C0603]  44.57 88.08 0 top
C14  100nF  [C0603]  53.62 70.37 0 top
C15  100nF  [C0603]  44.61 79.19 0 top
C16  22uF  [C1206]  43.94 57.57 90 top
C17  10uF  [C1206]  51.69 57.57 90 top
C20  100nF  [C0603]  13 62.19 270 top
C28  100nF  [C0603]  15.15 59.11 270 top
C29  100nF  [C0603]  18.56 65.47 0 top
CN1  B2PS-VH(LF)(SN)  [CONN-TH_B2PS-VH-LF-SN]  7.62 14.9 0 top
CN2  S4B-XH-A(LF)(SN)  [CONN-TH_S4B-XH-A-LF-SN]  18.8 9.18 180 top
CN3  DG381-3.5-02P-14-00A(H)  [CONN-TH_2P-P3.50_DG381-3.5-02P-14-00A]  56.77 3.47 0 top
CN5  DG381-3.5-02P-14-00A(H)  [CONN-TH_2P-P3.50_DG381-3.5-02P-14-00A]  49.02 3.47 0 top
CN6  DG381-3.5-02P-14-00A(H)  [CONN-TH_2P-P3.50_DG381-3.5-02P-14-00A]  41.02 3.47 0 top
D1  SS14  [SMA_L4.2-W2.6-LS5.0-RD_1]  56.76 8.93 0 top
D3  SMBJ12A  [SMB_L4.6-W3.6-LS5.3-RD]  7.64 18.58 180 top
D4  SS14  [SMA_L4.2-W2.6-LS5.0-RD_1]  41.15 9.44 0 top
D5  USBLC6-2SC6  [SOT-23-6_L2.9-W1.6-P0.95-LS2.8-BL]  50.67 80.05 90 top
EMERGENCY  TS-1187A-B-A-B  [SW-SMD_4P-L5.1-W5.1-P3.70-LS6.5-TL_H1.5]  53.65 66.05 90 top
EN  TS-1088-AR02016  [SW-SMD_L3.9-W3.0-P4.45]  60.71 71.28 180 top
G  -  [LED-TH_BD5.8-P2.54-FD]  8.25 76.02 180 top
H1  -  [HDR-TH_4P-P2.54-V-F]  26.54 66.97 180 top
H2  -  [HDR-TH_2P-P2.54-V-M-1]  52.2 86.4 0 top
NOREF  -  [Pad_e125]  61.59 32.11 0 top
NOREF#2  -  [Pad_e128]  61.59 36.11 0 top
NOREF#3  -  [Pad_e146]  2.66 36.11 0 top
NOREF#4  -  [Pad_e150]  2.66 32.11 0 top
Q1  AO3400A  [SOT-23-3_L2.9-W1.3-P1.90-LS2.4-BR]  58.67 12.1 180 top
Q2  AO3400A  [SOT-23-3_L2.9-W1.3-P1.90-LS2.4-BR]  17.4 19.59 90 top
Q3  AO3400A  [SOT-23-3_L2.9-W1.3-P1.90-LS2.4-BR]  43.05 12.61 180 top
Q4  AO3401A  [SOT-23_L2.9-W1.3-P1.90-LS2.4-BR]  13.34 17.69 270 top
R  -  [LED-TH_BD5.8-P2.54-FD]  8.37 69.16 180 top
R1  10kΩ  [R0603]  15.11 85.25 0 top
R2  5.1kΩ  [R0402]  54.87 77.88 90 top
R3  5.1kΩ  [R0402]  54.87 81.94 270 top
R5  10kΩ  [R0603]  25.15 64.17 270 top
R6  10kΩ  [R0603]  22.74 64.17 270 top
R8  51Ω  [R1206]  27.24 13.76 0 top
R9  150Ω  [R1210]  24.13 16.55 0 top
R10  348kΩ  [R0603]  3.17 59.22 270 top
R11  12kΩ  [R0603]  5.97 60.11 180 top
R12  430Ω  [R0603]  3.18 69.2 0 top
R13  470Ω  [R0603]  3.03 82.97 0 top
R14  510Ω  [R0603]  3.03 76.05 0 top
R16  100Ω  [R0603]  20.57 20.61 180 top
R17  10kΩ  [R0603]  19.67 18.46 90 top
R19  100Ω  [R0603]  53.94 12.99 0 top
R20  10kΩ  [R0603]  56.26 12.21 90 top
R21  120Ω  [R0603]  16.38 10.83 180 top
R26  10kΩ  [R0603]  16.41 16.29 270 top
R28  10kΩ  [R0603]  40.51 12.61 90 top
R29  100Ω  [R0603]  38.29 13.45 0 top
R30  22Ω  [R0603]  15.3 72.81 0 top
R31  22Ω  [R0603]  15.3 71.22 0 top
R32  10kΩ  [R0603]  38.1 67.86 90 top
SB1  Jumper  [PAD-JUMPER-2-NC_BY_PASTE_YES_SILK]  50.16 74.46 0 top
SETTING  TS-1187A-B-A-B  [SW-SMD_4P-L5.1-W5.1-P3.70-LS6.5-TL_H1.5]  44.67 74.88 90 top
START  TS-1187A-B-A-B  [SW-SMD_4P-L5.1-W5.1-P3.70-LS6.5-TL_H1.5]  44.67 83.77 90 top
STOP  TS-1187A-B-A-B  [SW-SMD_4P-L5.1-W5.1-P3.70-LS6.5-TL_H1.5]  44.67 66.05 90 top
U1  ESP32-S3-WROOM-1-N16R8  [WIRELM-SMD_ESP32-S3-WROOM-1]  26.54 79.03 0 top
U5  ADS1115IDGSR  [MSOP-10_L3.0-W3.0-P0.50-LS5.0-BL]  8.99 62.31 270 top
U6  AMS1117-3.3  [SOT-223-3_L6.5-W3.4-P2.30-LS7.0-BR]  27.03 57.8 0 top
U8  LMZM23601V5SILR  [USIP-10_L3.8-W3.0-TL_TI_SIL]  47.63 57.58 180 top
U10  DG301-5.0-02P-14-00A(H)  [CONN-TH_DEGSON_DG301-5.0-02P]  31.62 3.09 0 top
U12  TJA1051T/3/1J  [SOIC-8_L4.9-W3.9-P1.27-LS6.0-BL]  18.57 60.77 180 top
USB1  TYPE-C16PIN  [USB-C-SMD_TYPE-C16PIN]  58.81 79.66 90 top
Y  -  [LED-TH_BD5.8-P2.54-FD]  8.22 83 180 top

## Footprints (pads in the part's own frame, mm; a bottom-side part is the same pattern mirrored in y, then rotated)
C0603
  rect 0.8x0.9 smd: 1(-0.7,0) 2(0.7,0)
C1206
  rect 1.485x1.728 smd: 1(-1.593,0) 2(1.593,0)
CONN-TH_2P-P3.50_DG381-3.5-02P-14-00A
  round 1.9 hole 1.3: 1(-1.75,0) 2(1.75,0)
CONN-TH_B2PS-VH-LF-SN
  rect 2.5x2.5 hole 1.8: 1(-1.98,0)
  round 2.5 hole 1.8: 2(1.98,0)
CONN-TH_DEGSON_DG301-5.0-02P
  round 2 hole 1.2: 1(-2.5,0) 2(2.5,0)
CONN-TH_S4B-XH-A-LF-SN
  rect 1.6x1.6 hole 1: 1(3.75,0)
  round 1.6 hole 1: 2(1.25,0) 3(-1.25,0) 4(-3.75,0)
HDR-TH_2P-P2.54-V-M-1
  rect 1.8x1.8 hole 1.1: 1(-1.27,0)
  round 1.8 hole 1.1: 2(1.27,0)
HDR-TH_4P-P2.54-V-F
  rect 1.7x1.7 hole 1.1: 1(-3.81,0)
  round 1.7 hole 1.1: 2(-1.27,0) 3(1.27,0) 4(3.81,0)
LED-TH_BD5.8-P2.54-FD
  rect 1.6x1.6 hole 1: 1(-1.27,0)
  round 1.6 hole 1: 2(1.27,0)
MSOP-10_L3.0-W3.0-P0.50-LS5.0-BL
  oval 0.28x1.62 smd: 1(-1,-2.11) 2(-0.5,-2.11) 3(0,-2.11) 4(0.5,-2.11) 5(1,-2.11) 6(1,2.11) 7(0.5,2.11) 8(0,2.11) 9(-0.5,2.11) 10(-1,2.11)
PAD-JUMPER-2-NC_BY_PASTE_YES_SILK
  custom 1.156x0.914 smd: 1(-0.686,0)
  custom 1.105x0.914 smd: 2(0.584,0)
Pad_e125
  rect 3.048x1.524 hole 0.914: 1(0,0)
Pad_e128
  rect 3.048x1.524 hole 0.914: 1(0,0)
Pad_e146
  rect 3.048x1.524 hole 0.914: 1(0,0)
Pad_e150
  rect 3.048x1.524 hole 0.914: 1(0,0)
R0402
  rect 0.566x0.54 smd: 1(-0.433,0) 2(0.433,0)
R0603
  rect 0.806x0.864 smd: 1(-0.753,0) 2(0.753,0)
R1206
  rect 1.208x1.701 smd: 1(-1.479,0) 2(1.479,0)
R1210
  rect 1.282x2.808 smd: 1(-1.441,0) 2(1.441,0)
SMA_L4.2-W2.6-LS5.0-RD_1
  rect 1.52x1.68 smd: 1(-1.965,0) 2(1.965,0)
SMB_L4.6-W3.6-LS5.3-RD
  rect 2.047x2.192 smd: 1(-2.361,0) 2(2.361,0)
SOIC-8_L4.9-W3.9-P1.27-LS6.0-BL
  oval 0.588x2.045 smd: 1(-1.905,-2.772) 2(-0.635,-2.772) 3(0.635,-2.772) 4(1.905,-2.772) 5(1.905,2.772) 6(0.635,2.772) 7(-0.635,2.772) 8(-1.905,2.772)
SOT-23-3_L2.9-W1.3-P1.90-LS2.4-BR
  rect 1.25x0.7 smd: 1(1,0.95) 2(1,-0.95) 3(-1,0)
SOT-23-6_L2.9-W1.6-P0.95-LS2.8-BL
  rect 0.532x1.072 smd: 1(-0.95,-1.149) 2(0,-1.149) 3(0.95,-1.149) 4(0.95,1.149) 5(0,1.149) 6(-0.95,1.149)
SOT-23_L2.9-W1.3-P1.90-LS2.4-BR
  rect 1x0.8 smd: 1(1.15,-0.95) 2(1.15,0.95) 3(-1.15,0)
SOT-223-3_L6.5-W3.4-P2.30-LS7.0-BR
  rect 2.5x1.1 smd: 1(2.97,-2.3) 2(2.97,0) 3(2.97,2.3)
  rect 2.34x3.6 smd: 4(-2.97,0)
SW-SMD_4P-L5.1-W5.1-P3.70-LS6.5-TL_H1.5
  rect 1x0.75 smd: 1(-3,1.875) 2(3,1.875) 3(-3,-1.875) 4(3,-1.875)
SW-SMD_L3.9-W3.0-P4.45
  rect 1.23x1.36 smd: 1(-2.185,0) 2(2.185,0)
USB-C-SMD_TYPE-C16PIN
  oval 1x2.1 hole 0.6x1.7: 1(-4.32,1.788) 2(4.32,1.788)
  oval 1x1.8 hole 0.6x1.4: 3(-4.32,-2.362) 4(4.32,-2.362)
  rect 0.6x1.15 smd: A1B12(-3.2,2.362) A4B9(-2.4,2.362) B1A12(3.2,2.362) B4A9(2.4,2.362)
  rect 0.3x1.15 smd: A5(-1.25,2.362) A6(-0.25,2.362) A7(0.25,2.362) A8(1.25,2.362) B5(1.75,2.362) B6(0.75,2.362) B7(-0.75,2.362) B8(-1.75,2.362)
USIP-10_L3.8-W3.0-TL_TI_SIL
  rect 0.75x0.4 smd: 1(-1.525,1.2) 2(-1.525,0.6) 3(-1.525,0) 4(-1.525,-0.6) 5(-1.525,-1.2) 6(1.525,-1.2) 7(1.525,-0.6) 8(1.525,0) 9(1.525,0.6) 10(1.525,1.2)
  rect 0.8x3 smd: 11(-0.175,0)
WIRELM-SMD_ESP32-S3-WROOM-1
  rect 1.5x0.9 smd: 1(-8.75,8.895) 2(-8.75,7.625) 3(-8.75,6.355) 4(-8.75,5.085) 5(-8.75,3.815) 6(-8.75,2.545) 7(-8.75,1.275) 8(-8.75,0.005) 9(-8.75,-1.265) 10(-8.75,-2.535) 11(-8.75,-3.805) 12(-8.75,-5.075) 13(-8.75,-6.345) 14(-8.75,-7.615) 27(8.75,-7.615) 28(8.75,-6.345) 29(8.75,-5.075) 30(8.75,-3.805) 31(8.75,-2.535) 32(8.75,-1.265) 33(8.75,0.005) 34(8.75,1.275) 35(8.75,2.545) 36(8.75,3.815) 37(8.75,5.085) 38(8.75,6.355) 39(8.75,7.625) 40(8.75,8.895)
  rect 0.9x1.5 smd: 15(-6.985,-8.895) 16(-5.715,-8.895) 17(-4.445,-8.895) 18(-3.175,-8.895) 19(-1.905,-8.895) 20(-0.635,-8.895) 21(0.635,-8.895) 22(1.905,-8.895) 23(3.175,-8.895) 24(4.445,-8.895) 25(5.715,-8.895) 26(6.985,-8.865)
  rect 0.9x0.9 smd: 41(-2.9,2.575) 41(-2.9,1.175) 41(-2.9,-0.225) 41(-1.5,2.575) 41(-1.5,1.175) 41(-1.5,-0.225) 41(-0.1,2.575) 41(-0.1,1.175) 41(-0.1,-0.225)

## Nets
As in the schematic, except:
12V: C17.2 CN3.1 CN5.1 CN6.1 D1.1 D4.1 NOREF#2.1 Q4.2 R26.2 U8.3 U8.4
120V: NOREF#3.1 R10.2 U10.1
GND: BOOT.2 C1.1 C2.1 C3.1 C4.2 C7.2 C9.2 C10.2 C11.1 C12.2 C13.2 C14.2 C15.2 C16.1 C17.1 C20.2 C28.1 C29.2 CN1.1 CN2.3 D3.2 D5.2 EMERGENCY.3 EMERGENCY.4 EN.1 H1.1 NOREF.1 Q1.1 Q2.1 Q3.1 R2.1 R3.1 R8.2 R12.1 R13.1 R14.1 R17.1 R20.1 R28.1 SETTING.3 SETTING.4 START.3 START.4 STOP.3 STOP.4 U1.1 U1.40 U1.41 U5.1 U5.3 U5.7 U6.1 U8.1 U8.2 U8.11 U12.2 U12.8 USB1.1 USB1.2 USB1.3 USB1.4 USB1.A1B12 USB1.B1A12
GND_BACK: C8.1 NOREF#4.1 R11.1 U5.5 U10.2

Pads without a net: EMERGENCY 1; SETTING 1; STOP 1; U1 4 12 15 16 20 21 22 23 24 25 26 28 29 30 31 38 39; U5 2; U8 5 8 9 10; USB1 A8 B8

## Via types
v1: diameter 0.61, hole 0.305, Top Layer to Bottom Layer, 84 vias

## Routing (per net, layer and track width the routed paths; a pad name or vN(x,y) marks a point on that pad's centre or on a via; arc(x,y) is an arc through that point)
5V: length 52.7
  Top Layer w0.254: U6.3 30,61.35 v1(29.97,61.38) ; 46.1,58.78 46.37,59.04 v1(46.37,59.73) ; SB1.2 50.75,73.19 v1(50.77,73.17) ; C29.1 17.93,65.4 U12.3 v1(17.93,61.71)
  Top Layer w0.762: 46.1,58.31 46.1,58.78 45.72,59.16 C16.2 39.17,59.16 38.26,60.07 C9.1 30.02,60.07 U6.3
  Bottom Layer w0.254: v1(17.93,61.71) 19.16,60.49 29.08,60.49 v1(29.97,61.38) ; v1(46.37,59.73) 50.77,64.13 v1(50.77,73.17)
12V: length 149.5
  Top Layer w0.254: R26.2 15.41,16.54 Q4.2
  Top Layer w0.762: C17.2 50.35,57.82 49.15,57.82 ; 39.27,6.91 36.18,6.91 34.54,8.55 25.4,8.55 23.75,6.9 13.72,6.9 12.57,8.04 12.57,14.4 14.28,16.11 Q4.2
  Top Layer w1.27: CN3.1 55.02,8.71 D1.1 ; NOREF#2.1 61.59,55.66 58.17,59.09 51.76,59.09 C17.2 ; CN6.1 39.27,9.35 D4.1
  Bottom Layer w1.27: CN5.1 47.27,32.07 51.31,36.11 61.59,36.11 NOREF#2.1 ; CN5.1 45.37,5.37 40.89,5.37 39.27,3.75 CN6.1 ; CN5.1 49.18,5.37 53.11,5.37 CN3.1
120V: length 86.5
  Top Layer w0.254: NOREF#3.1 3.17,36.62 R10.2
  Bottom Layer w1.27: NOREF#3.1 2.91,35.86 6.09,35.86 6.98,34.96 6.98,31.03 1.91,25.95 1.91,6.64 5.46,3.09 U10.1
GND:
  vias: v1(1.14,82.97) v1(1.14,75.98) v1(1.14,69.13) v1(3.65,18.58) v1(7.67,59.98) v1(8.25,87.54) v1(13.21,59.98) v1(14.99,20.74) v1(15.15,61.08) v1(18.24,16.73) v1(19.18,66.59) v1(19.3,87.92) v1(19.69,16.73) v1(20.45,56.43) v1(22.48,81.57) v1(22.48,80.17) v1(22.48,78.78) v1(23.62,82.84) v1(23.62,77.51) v1(25.02,82.84) v1(25.05,77.51) v1(26.29,82.84) v1(26.42,61.12) v1(26.54,77.51) v1(27.69,81.57) v1(27.69,80.3) v1(27.69,78.82) v1(30.1,54.27) v1(30.48,13.75) v1(33.15,52.97) v1(34.04,87.92) v1(36.96,75.48) v1(36.96,73.83) v1(36.96,72.05) v1(40,79.92) v1(43.94,54.39) v1(45.34,69) v1(45.97,55.41) v1(46.48,87.92) v1(46.61,79.29) v1(46.61,70.52) v1(47.55,63.05) v1(47.8,59.68) v1(47.8,55.45) v1(49.28,55.41) v1(49.4,59.73) v1(51.69,54.39) v1(53.47,81.06) v1(55.63,70.4) v1(56.64,63.16) v1(62.74,65.32) v1(62.76,73.85)
GND_BACK: length 93
  Top Layer w0.254: U5.5 6.72,61.16 R11.1 6.67,60.05 C8.1 6.67,55.22 5.46,54.01 5.46,34.91 NOREF#4.1
  Top Layer w1.27: U10.2 31.58,5.62 27.56,5.62 25.02,3.09 5.46,3.09 1.97,6.58 1.97,26.2 3.33,27.56 3.33,31.44 NOREF#4.1
VBUS: length 27.2
  Top Layer w0.254: 49.48,74.46 47.75,76.19 47.75,79.67 ; 47.75,79.67 47.75,82.33 48.77,83.35 55.12,83.35 55.5,82.97 55.5,82.54 55.76,82.28 56.23,82.28 USB1.B4A9 56.46,82.07 57.14,82.07 57.78,81.43 57.78,77.89 57.15,77.26 USB1.A4B9 ; 47.75,79.67 48.13,80.05 D5.5
VDD33: length 96.7
  Top Layer w0.254: C3.2 17.48,86.97 U1.2 ; C20.1 12.42,62.31 U5.8 ; v1(36.96,57.82) 36.86,57.72 C10.1 ; R32.1 v1(38.1,65.95)
  Top Layer w0.508: v1(14.48,86.78) 13.66,86.78 C1.2 ; v1(14.48,86.78) 14.48,85.37 R1.1 ; v1(14.48,86.78) 15.69,86.78 C3.2 ; 14.22,62.39 13.73,62.89 C20.1 ; 14.22,62.39 14.22,59.34 14.3,59.27 14.3,59.25 14.53,59.01 14.56,59.01 C28.2 16.25,58.41 U12.5 16.79,58.12 16.79,59.5 17.15,59.85 22,59.85 U6.4 ; 14.22,62.39 v1(14.22,63.98)
  Top Layer w0.762: R5.2 25.15,58.88 U6.4 24.06,58.65 22.73,59.98 22.73,63.4 22.74,63.41
  Top Layer w1.016: 27.04,57.8 U6.2 33.08,57.8 C10.1 ; 27.04,57.8 U6.4 ; 27.04,57.8 27.04,59.88 27.89,60.72 27.89,66.89 27.81,66.97
  Bottom Layer w0.254: v1(38.1,65.95) 36.96,64.81 v1(36.96,57.82)
  Bottom Layer w0.508: v1(14.48,86.78) 12.7,85 12.7,65.51 v1(14.22,63.98)
CANH: length 50.4
  Top Layer w0.254: U12.7 19.2,57.99 v1(19.2,56.43) ; v1(17.21,12.1) 17.14,12.03 R21.1 17.14,9.76 17.55,9.35 CN2.2
  Bottom Layer w0.254: v1(19.2,56.43) 18.72,55.95 18.72,48.23 16.56,46.06 16.56,12.76 v1(17.21,12.1)
CANL: length 50.5
  Top Layer w0.254: v1(15.49,12.1) 15.63,11.97 R21.2 15.63,9.93 15.05,9.35 CN2.1 ; U12.6 17.91,57.97 v1(17.91,56.43)
  Bottom Layer w0.254: v1(15.49,12.1) 16.15,12.76 16.15,46.22 18.32,48.39 18.32,56.01 v1(17.91,56.43)
COUPLER: length 9.7
  Top Layer w0.762: CN6.2 43.11,3.81 D4.2 44.05,10.38 Q3.3
CP: length 7.4
  Top Layer w0.762: R9.1 22.55,16.4 CN2.4
D+: length 1.8
  Top Layer w0.254: U1.14 17.6,71.22 R31.2
D-: length 1.8
  Top Layer w0.254: R30.2 17.67,72.81 U1.13
DC_RELAY: length 20.7
  Top Layer w0.762: CN5.2 50.77,1.69 51.31,1.15 57.66,1.15 58.52,2.01 CN3.2
  Top Layer w1.016: CN3.2 58.52,8.72 D1.2 59.67,9.87 Q1.3
EN: length 64.5
  Top Layer w0.254: C2.2 15.81,85.2 R1.2 17.66,85.25 U1.3 17.92,85.26 18.93,85.26 22.43,88.76 43.31,88.76 43.35,88.81 45.79,88.81 45.83,88.76 58.21,88.76 59.88,87.1 59.88,84.18 59.87,84.17 59.87,74.89 59.88,74.88 59.88,73.95 C4.1 60.01,72.77 EN.2
IO0: length 30.4
  Top Layer w0.254: BOOT.1 59.91,66.39 C11.2 59.25,65.95 40.76,65.95 R32.2 U1.27
IO5: length 8.4
  Top Layer w0.254: U1.5 9.65,82.85 Y.1
IO6: length 10.6
  Top Layer w0.254: U1.6 15.37,81.58 9.81,76.02 G.1
IO7: length 16
  Top Layer w0.254: R.1 10.07,69.16 12.19,71.28 12.19,76.87 15.49,80.17 17.66,80.17 U1.7
IO9: length 64.2
  Top Layer w0.254: v1(32,65.19) 32,67.86 31.62,68.24 22.48,68.24 22.1,68.62 U1.17 ; R16.1 22.61,20.61 v1(22.73,20.74)
  Bottom Layer w0.254: v1(32,65.19) 32,57.7 22.73,48.42 v1(22.73,20.74)
IO10: length 68
  Top Layer w0.254: v1(32.8,65.19) 32.77,65.22 32.77,67.6 31.77,68.59 24.59,68.59 23.37,69.81 U1.18 ; R29.1 37.54,15.1 v1(38.99,16.55)
  Bottom Layer w0.254: v1(32.8,65.19) 32.8,57.51 38.99,51.32 v1(38.99,16.55)
IO11: length 76.6
  Top Layer w0.254: R19.1 53.09,13.09 53.09,14.39 50.55,16.93 v1(44.52,16.93) ; U1.19 24.64,69.81 25.5,68.95 31.92,68.95 33.53,67.34 33.53,65.27 v1(33.61,65.19)
  Bottom Layer w0.254: v1(33.61,65.19) 33.38,64.96 33.38,64.95 33.15,64.72 33.15,58.83 39.95,52.04 39.95,21.5 v1(44.52,16.93)
IO17: length 14.3
  Top Layer w0.254: U1.10 18.33,75.96 18.66,75.96 18.82,75.79 18.82,70.85 18.8,70.82 18.8,68.36 20.47,66.68 U12.1
IO18: length 13.5
  Top Layer w0.254: U12.4 15.37,64.84 15.37,72.8 15.38,72.81 15.38,73.35 16.71,74.69 17.25,74.69 U1.11
IO39: length 14.6
  Top Layer w0.254: C12.1 43.85,70.1 STOP.2 39.62,72.22 39.62,75.1 36.96,77.77 U1.32
IO40: length 22.4
  Top Layer w0.254: U1.33 37.71,79.04 42.67,74.08 46.74,74.08 EMERGENCY.2 52.92,70.2 C14.1
IO41: length 10.3
  Top Layer w0.254: U1.34 37.21,80.31 39.64,77.88 SETTING.2 43.91,78.99 C15.1
IO42: length 7.8
  Top Layer w0.254: START.1 41.99,81.58 U1.35
RXD0: length 19.6
  Top Layer w0.254: v1(36.96,82.86) 36.94,82.85 U1.36
  Bottom Layer w0.254: v1(36.96,82.86) 49.93,82.86 H2.2
SCL: length 37
  Top Layer w0.254: U5.10 11.1,63.97 v1(11.18,64.05) ; U1.8 v1(16.5,79.04)
  Top Layer w0.762: R5.1 25.15,66.84 H1.3
  Bottom Layer w0.254: v1(11.18,64.05) 11.18,63.03 11.68,62.52 20.83,62.52 H1.3 25.27,70.26 v1(16.5,79.04)
SDA: length 32.4
  Top Layer w0.254: v1(16.51,77.76) 17.79,77.76 U1.9 ; U5.9 11.18,62.89 11.94,62.89 12.19,63.14 12.19,63.49 12.18,63.49 v1(12.18,64.05)
  Top Layer w0.762: R6.1 22.74,66.96 H1.4
  Bottom Layer w0.254: v1(16.51,77.76) 22.73,71.54 H1.4 22.73,65.57 20.32,63.16 12.57,63.16 12.18,63.55 v1(12.18,64.05)
TXD0: length 16.7
  Top Layer w0.254: v1(36.96,83.98) 36.82,84.12 U1.37
  Bottom Layer w0.254: H2.1 48.51,83.98 v1(36.96,83.98)
UD+: length 12
  Top Layer w0.254: D5.1 50.68,79.1 v1(50.67,79.1) ; v1(54.74,80.3) 54.84,80.41 USB1.B6 56.38,80.34 55.76,80.34 55.59,80.17 55.59,79.57 55.76,79.41 USB1.A6
  Bottom Layer w0.254: v1(54.74,80.3) 54.74,79.98 55.32,79.4 55.32,78.91 54.98,78.57 52.51,78.57 51.98,79.1 v1(50.67,79.1)
UD-: length 12
  Top Layer w0.254: v1(50.67,80.98) 50.69,81 D5.3 ; v1(54.74,79.15) 54.98,78.91 USB1.B7 56.52,78.98 57.14,78.98 57.3,79.14 57.3,79.67 57.07,79.91 USB1.A7
  Bottom Layer w0.254: v1(50.67,80.98) 51.26,80.98 51.32,80.93 51.68,80.93 51.95,81.2 52.31,81.2 52.62,80.9 52.62,80.64 52.17,80.2 52.17,79.94 53,79.12 53.25,79.12 53.7,79.56 53.95,79.56 54.36,79.15 v1(54.74,79.15)
VP: length 7.3
  Top Layer w0.762: D3.1 10.26,18.84 Q4.3
  Top Layer w1.27: D3.1 10,15.3 CN1.2
$1N24268: length 3.2
  Top Layer w0.254: Y.2 3.82,83 R13.2
$1N24269: length 3.2
  Top Layer w0.254: R14.2 3.82,76.02 G.2
$1N24273: length 3.2
  Top Layer w0.254: R.2 3.96,69.16 R12.2
$1N24295: length 1.6
  Top Layer w0.254: 54.87,78.31 54.97,78.41 USB1.A5
$1N24313: length 53.8
  Top Layer w0.254: C7.1 11.1,60.1 U5.6
  Top Layer w0.762: R8.1 25.76,16.35 R9.2 25.57,23.87 10.92,38.52 10.92,59.88 C7.1
$1N24345: length 6.7
  Top Layer w0.254: R10.1 5.08,59.97 R11.2 ; C8.2 5.27,60.05 R11.2 ; R11.2 5.22,60.92 6.03,61.73 6.8,61.73 U5.4
$1N24383: length 1.8
  Top Layer w0.254: START.2 43.87,87.84 C13.1
$1N24443: length 1.6
  Top Layer w0.254: 54.87,81.51 54.98,81.41 USB1.B5
$1N35533: length 7.1
  Top Layer w0.254: 12.38,16.54 12.38,17.12 12.95,17.69 15.76,17.69 16.41,17.04 17.4,18.03 Q2.3
$1N35540: length 2.9
  Top Layer w0.254: R17.2 19.82,19.36 R16.2 19.8,20.59 Q2.2
$1N38322: length 49
  Top Layer w0.254: D5.6 48.54,79.1 v1(48.51,79.07) ; R31.1 14.49,71.16 v1(13.46,71.16)
  Bottom Layer w0.254: v1(48.51,79.07) 48.51,79.68 48.33,79.86 47.91,79.86 46.99,80.78 36.15,80.78 33.37,83.57 18.7,83.57 14.92,79.79 14.92,72.2 14.51,71.78 14.08,71.78 v1(13.46,71.16)
$1N38324: length 49
  Top Layer w0.254: v1(13.46,72.81) 14.55,72.81 R30.1 ; v1(48.51,81.06) 48.58,81 D5.4
  Bottom Layer w0.254: v1(48.51,81.06) 48.51,80.45 48.33,80.27 48.08,80.27 47.16,81.19 36.32,81.19 33.54,83.98 18.53,83.98 14.52,79.96 14.52,72.37 14.34,72.19 14.08,72.19 v1(13.46,72.81)
$3N445: length 3
  Top Layer w0.254: R19.2 56.23,12.99 R20.2 57.59,12.97 Q1.2
$3N451: length 3.1
  Top Layer w0.254: R29.2 40.43,13.45 R28.2 41.86,13.36 Q3.2

## Copper pours and planes (outline as drawn; the poured copper is in the pictures)
GND on Top Layer: 0,89.32 64.13,89.32 64.13,0 0,0
GND on Bottom Layer: 0.13,89.32 64.26,89.32 64.26,0 0.13,0

Small or netless copper shapes (teardrops, artwork), in the pictures only: 220 on Top Layer, 44 on Bottom Layer

## Text on the board
Top Silkscreen Layer: TES SECC V1.2 | Chris Huang | 2025 | GD | VP | Coupler | + - | DC Relay | D- | D+ | GND | CP | 120V | DC120V-DC12V Buck
